# EAGLE design MIU60_REVB (EAGLE 6.5.0)
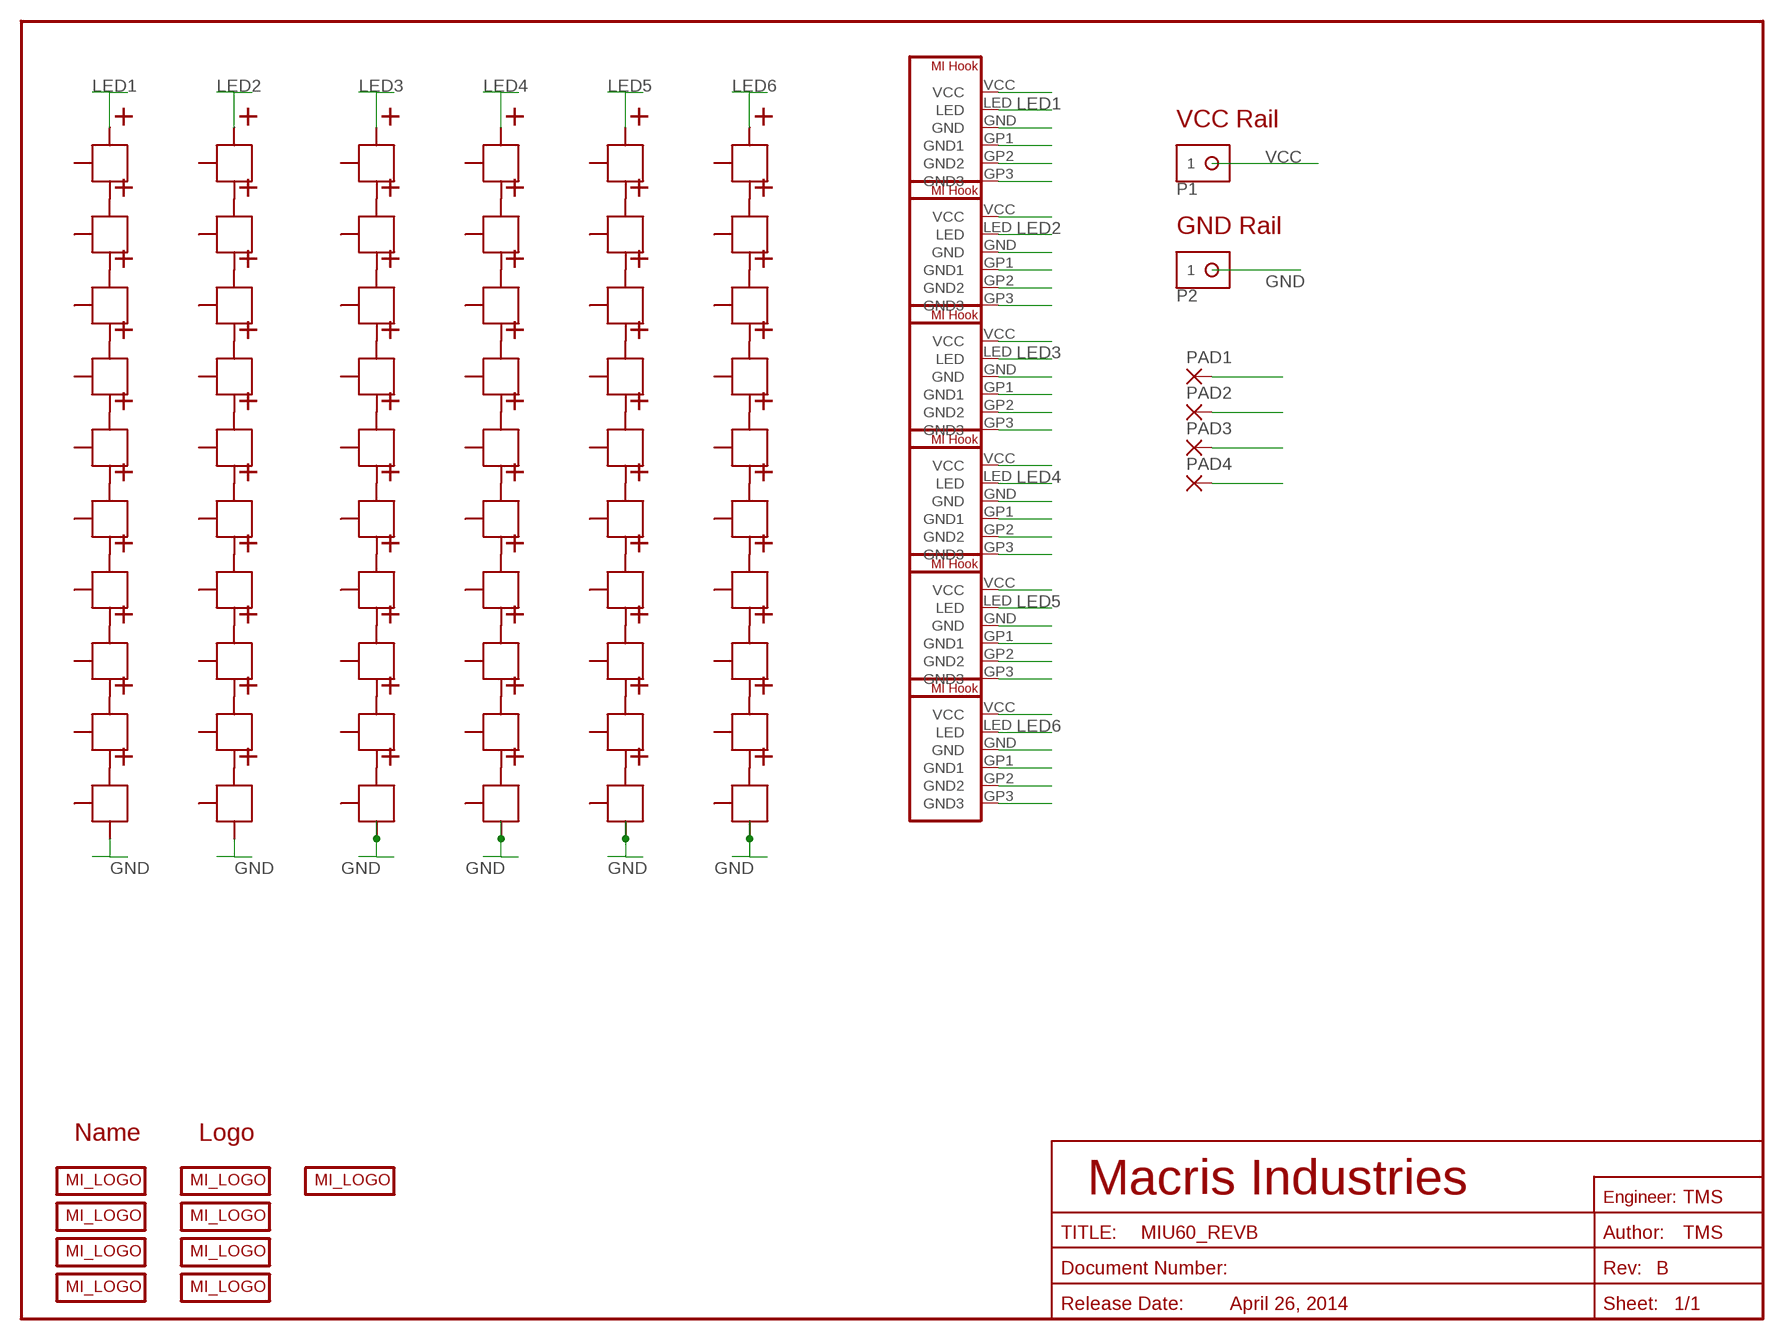
[diagram p0: schematic, sheet 1]

## Parts
P1  PAD-10G  [PAD_10G]
P2  PAD-10G  [PAD_10G]
PAD1  SMD5  [SMD2,54-5,08]
PAD2  SMD5  [SMD2,54-5,08]
PAD3  SMD5  [SMD2,54-5,08]
PAD4  SMD5  [SMD2,54-5,08]
U$1  MI_LOGO-50MIL  MI_LOGO-NAME_TWO  [MI_LOGO_NAME_2]
U$2  MI_LOGO-2014_USA  [MACRIS_USA_LOGO]
U$3  MI_LOGO-50MIL  MI_LOGO-NAME_TWO  [MI_LOGO_NAME_2]
U$4  MI_LOGO-2014_USA  [MACRIS_USA_LOGO]
U$5  MI_LOGO-50MIL  MI_LOGO-NAME_TWO  [MI_LOGO_NAME_2]
U$6  MI_LOGO-50MIL  MI_LOGO-NAME_TWO  [MI_LOGO_NAME_2]
U$7  MI_LOGO-2014_USA  [MACRIS_USA_LOGO]
U$8  MI_LOGO-2014_USA  [MACRIS_USA_LOGO]
U$9  MI_DRIVER_HOOKUP  [MI_DRIVE_HOOKUP]
U$10  MI_DRIVER_HOOKUP  [MI_DRIVE_HOOKUP]
U$11  MI_DRIVER_HOOKUP  [MI_DRIVE_HOOKUP]
U$12  MI_DRIVER_HOOKUP  [MI_DRIVE_HOOKUP]
U$13  MI_DRIVER_HOOKUP  [MI_DRIVE_HOOKUP]
U$14  MI_DRIVER_HOOKUP  [MI_DRIVE_HOOKUP]
U$15  MI_LOGO  [MACRIS_MIU30]
U$16  CREE_XP  [XP]
U$17  CREE_XP  [XP]
U$18  CREE_XP  [XP]
U$19  CREE_XP  [XP]
U$20  CREE_XP  [XP]
U$21  CREE_XP  [XP]
U$22  CREE_XP  [XP]
U$23  CREE_XP  [XP]
U$24  CREE_XP  [XP]
U$25  CREE_XP  [XP]
U$26  CREE_XP  [XP]
U$27  CREE_XP  [XP]
U$28  CREE_XP  [XP]
U$29  CREE_XP  [XP]
U$30  CREE_XP  [XP]
U$31  CREE_XP  [XP]
U$32  CREE_XP  [XP]
U$33  CREE_XP  [XP]
U$34  CREE_XP  [XP]
U$35  CREE_XP  [XP]
U$36  CREE_XP  [XP]
U$37  CREE_XP  [XP]
U$38  CREE_XP  [XP]
U$39  CREE_XP  [XP]
U$40  CREE_XP  [XP]
U$41  CREE_XP  [XP]
U$42  CREE_XP  [XP]
U$43  CREE_XP  [XP]
U$44  CREE_XP  [XP]
U$45  CREE_XP  [XP]
U$46  CREE_XP  [XP]
U$47  CREE_XP  [XP]
U$48  CREE_XP  [XP]
U$49  CREE_XP  [XP]
U$50  CREE_XP  [XP]
U$51  CREE_XP  [XP]
U$52  CREE_XP  [XP]
U$53  CREE_XP  [XP]
U$54  CREE_XP  [XP]
U$55  CREE_XP  [XP]
U$56  CREE_XP  [XP]
U$57  CREE_XP  [XP]
U$58  CREE_XP  [XP]
U$59  CREE_XP  [XP]
U$60  CREE_XP  [XP]
U$61  CREE_XP  [XP]
U$62  CREE_XP  [XP]
U$63  CREE_XP  [XP]
U$64  CREE_XP  [XP]
U$65  CREE_XP  [XP]
U$66  CREE_XP  [XP]
U$67  CREE_XP  [XP]
U$68  CREE_XP  [XP]
U$69  CREE_XP  [XP]
U$70  CREE_XP  [XP]
U$71  CREE_XP  [XP]
U$72  CREE_XP  [XP]
U$73  CREE_XP  [XP]
U$74  CREE_XP  [XP]
U$75  CREE_XP  [XP]

## Nets
GND: P2.1 PAD3.1(P) PAD4.1(P) U$9.GND U$9.GP2(GND2) U$10.GND U$11.GND U$11.GP2(GND2) U$12.GND U$12.GP2(GND2) U$13.GND U$13.GP2(GND2) U$14.GND U$14.GP2(GND2) U$25.NEGATIVE U$25.NEGATIVE1(NEGATIVE) U$35.NEGATIVE U$35.NEGATIVE1(NEGATIVE) U$45.NEGATIVE U$45.NEGATIVE1(NEGATIVE) U$55.NEGATIVE U$55.NEGATIVE1(NEGATIVE) U$65.NEGATIVE U$65.NEGATIVE1(NEGATIVE) U$75.NEGATIVE U$75.NEGATIVE1(NEGATIVE)
LED1: U$9.LED U$16.POSITIVE U$16.POSITIVE1(POSITIVE)
LED2: U$10.LED U$26.POSITIVE U$26.POSITIVE1(POSITIVE)
LED3: U$11.LED U$36.POSITIVE U$36.POSITIVE1(POSITIVE)
LED4: U$12.LED U$46.POSITIVE U$46.POSITIVE1(POSITIVE)
LED5: U$13.LED U$56.POSITIVE U$56.POSITIVE1(POSITIVE)
LED6: U$14.LED U$66.POSITIVE U$66.POSITIVE1(POSITIVE)
N$1: U$16.NEGATIVE U$16.NEGATIVE1(NEGATIVE) U$17.POSITIVE U$17.POSITIVE1(POSITIVE)
N$2: U$17.NEGATIVE U$17.NEGATIVE1(NEGATIVE) U$18.POSITIVE U$18.POSITIVE1(POSITIVE)
N$3: U$18.NEGATIVE U$18.NEGATIVE1(NEGATIVE) U$19.POSITIVE U$19.POSITIVE1(POSITIVE)
N$4: U$19.NEGATIVE U$19.NEGATIVE1(NEGATIVE) U$20.POSITIVE U$20.POSITIVE1(POSITIVE)
N$5: U$20.NEGATIVE U$20.NEGATIVE1(NEGATIVE) U$21.POSITIVE U$21.POSITIVE1(POSITIVE)
N$6: U$21.NEGATIVE U$21.NEGATIVE1(NEGATIVE) U$22.POSITIVE U$22.POSITIVE1(POSITIVE)
N$7: U$22.NEGATIVE U$22.NEGATIVE1(NEGATIVE) U$23.POSITIVE U$23.POSITIVE1(POSITIVE)
N$8: U$23.NEGATIVE U$23.NEGATIVE1(NEGATIVE) U$24.POSITIVE U$24.POSITIVE1(POSITIVE)
N$9: U$24.NEGATIVE U$24.NEGATIVE1(NEGATIVE) U$25.POSITIVE U$25.POSITIVE1(POSITIVE)
N$10: U$56.NEGATIVE U$56.NEGATIVE1(NEGATIVE) U$57.POSITIVE U$57.POSITIVE1(POSITIVE)
N$11: U$57.NEGATIVE U$57.NEGATIVE1(NEGATIVE) U$58.POSITIVE U$58.POSITIVE1(POSITIVE)
N$12: U$26.NEGATIVE U$26.NEGATIVE1(NEGATIVE) U$27.POSITIVE U$27.POSITIVE1(POSITIVE)
N$13: U$27.NEGATIVE U$27.NEGATIVE1(NEGATIVE) U$28.POSITIVE U$28.POSITIVE1(POSITIVE)
N$14: U$28.NEGATIVE U$28.NEGATIVE1(NEGATIVE) U$29.POSITIVE U$29.POSITIVE1(POSITIVE)
N$15: U$29.NEGATIVE U$29.NEGATIVE1(NEGATIVE) U$30.POSITIVE U$30.POSITIVE1(POSITIVE)
N$16: U$30.NEGATIVE U$30.NEGATIVE1(NEGATIVE) U$31.POSITIVE U$31.POSITIVE1(POSITIVE)
N$17: U$32.NEGATIVE U$32.NEGATIVE1(NEGATIVE) U$33.POSITIVE U$33.POSITIVE1(POSITIVE)
N$18: U$33.NEGATIVE U$33.NEGATIVE1(NEGATIVE) U$34.POSITIVE U$34.POSITIVE1(POSITIVE)
N$19: U$34.NEGATIVE U$34.NEGATIVE1(NEGATIVE) U$35.POSITIVE U$35.POSITIVE1(POSITIVE)
N$20: U$31.NEGATIVE U$31.NEGATIVE1(NEGATIVE) U$32.POSITIVE U$32.POSITIVE1(POSITIVE)
N$21: U$66.NEGATIVE U$66.NEGATIVE1(NEGATIVE) U$67.POSITIVE U$67.POSITIVE1(POSITIVE)
N$22: U$13.GP1(GND1)
N$23: U$13.GP3(GND3)
N$24: U$36.NEGATIVE U$36.NEGATIVE1(NEGATIVE) U$37.POSITIVE U$37.POSITIVE1(POSITIVE)
N$25: U$37.NEGATIVE U$37.NEGATIVE1(NEGATIVE) U$38.POSITIVE U$38.POSITIVE1(POSITIVE)
N$26: U$38.NEGATIVE U$38.NEGATIVE1(NEGATIVE) U$39.POSITIVE U$39.POSITIVE1(POSITIVE)
N$27: U$39.NEGATIVE U$39.NEGATIVE1(NEGATIVE) U$40.POSITIVE U$40.POSITIVE1(POSITIVE)
N$28: U$40.NEGATIVE U$40.NEGATIVE1(NEGATIVE) U$41.POSITIVE U$41.POSITIVE1(POSITIVE)
N$29: U$41.NEGATIVE U$41.NEGATIVE1(NEGATIVE) U$42.POSITIVE U$42.POSITIVE1(POSITIVE)
N$30: U$42.NEGATIVE U$42.NEGATIVE1(NEGATIVE) U$43.POSITIVE U$43.POSITIVE1(POSITIVE)
N$31: U$43.NEGATIVE U$43.NEGATIVE1(NEGATIVE) U$44.POSITIVE U$44.POSITIVE1(POSITIVE)
N$32: U$44.NEGATIVE U$44.NEGATIVE1(NEGATIVE) U$45.POSITIVE U$45.POSITIVE1(POSITIVE)
N$33: U$58.NEGATIVE U$58.NEGATIVE1(NEGATIVE) U$59.POSITIVE U$59.POSITIVE1(POSITIVE)
N$34: U$59.NEGATIVE U$59.NEGATIVE1(NEGATIVE) U$60.POSITIVE U$60.POSITIVE1(POSITIVE)
N$35: U$67.NEGATIVE U$67.NEGATIVE1(NEGATIVE) U$68.POSITIVE U$68.POSITIVE1(POSITIVE)
N$36: U$46.NEGATIVE U$46.NEGATIVE1(NEGATIVE) U$47.POSITIVE U$47.POSITIVE1(POSITIVE)
N$37: U$47.NEGATIVE U$47.NEGATIVE1(NEGATIVE) U$48.POSITIVE U$48.POSITIVE1(POSITIVE)
N$38: U$48.NEGATIVE U$48.NEGATIVE1(NEGATIVE) U$49.POSITIVE U$49.POSITIVE1(POSITIVE)
N$39: U$49.NEGATIVE U$49.NEGATIVE1(NEGATIVE) U$50.POSITIVE U$50.POSITIVE1(POSITIVE)
N$40: U$50.NEGATIVE U$50.NEGATIVE1(NEGATIVE) U$51.POSITIVE U$51.POSITIVE1(POSITIVE)
N$41: U$51.NEGATIVE U$51.NEGATIVE1(NEGATIVE) U$52.POSITIVE U$52.POSITIVE1(POSITIVE)
N$42: U$52.NEGATIVE U$52.NEGATIVE1(NEGATIVE) U$53.POSITIVE U$53.POSITIVE1(POSITIVE)
N$43: U$53.NEGATIVE U$53.NEGATIVE1(NEGATIVE) U$54.POSITIVE U$54.POSITIVE1(POSITIVE)
N$44: U$68.NEGATIVE U$68.NEGATIVE1(NEGATIVE) U$69.POSITIVE U$69.POSITIVE1(POSITIVE)
N$45: U$14.GP1(GND1)
N$46: U$54.NEGATIVE U$54.NEGATIVE1(NEGATIVE) U$55.POSITIVE U$55.POSITIVE1(POSITIVE)
N$47: U$60.NEGATIVE U$60.NEGATIVE1(NEGATIVE) U$61.POSITIVE U$61.POSITIVE1(POSITIVE)
N$48: U$61.NEGATIVE U$61.NEGATIVE1(NEGATIVE) U$62.POSITIVE U$62.POSITIVE1(POSITIVE)
N$49: U$62.NEGATIVE U$62.NEGATIVE1(NEGATIVE) U$63.POSITIVE U$63.POSITIVE1(POSITIVE)
N$50: U$63.NEGATIVE U$63.NEGATIVE1(NEGATIVE) U$64.POSITIVE U$64.POSITIVE1(POSITIVE)
N$51: U$64.NEGATIVE U$64.NEGATIVE1(NEGATIVE) U$65.POSITIVE U$65.POSITIVE1(POSITIVE)
N$52: U$69.NEGATIVE U$69.NEGATIVE1(NEGATIVE) U$70.POSITIVE U$70.POSITIVE1(POSITIVE)
N$53: U$70.NEGATIVE U$70.NEGATIVE1(NEGATIVE) U$71.POSITIVE U$71.POSITIVE1(POSITIVE)
N$54: U$71.NEGATIVE U$71.NEGATIVE1(NEGATIVE) U$72.POSITIVE U$72.POSITIVE1(POSITIVE)
N$55: U$72.NEGATIVE U$72.NEGATIVE1(NEGATIVE) U$73.POSITIVE U$73.POSITIVE1(POSITIVE)
N$56: U$73.NEGATIVE U$73.NEGATIVE1(NEGATIVE) U$74.POSITIVE U$74.POSITIVE1(POSITIVE)
N$57: U$74.NEGATIVE U$74.NEGATIVE1(NEGATIVE) U$75.POSITIVE U$75.POSITIVE1(POSITIVE)
N$60: U$14.GP3(GND3)
N$61: U$10.GP3(GND3)
N$62: U$10.GP2(GND2)
N$63: U$10.GP1(GND1)
N$65: U$11.GP1(GND1)
N$66: U$11.GP3(GND3)
N$68: U$12.GP1(GND1)
N$69: U$12.GP3(GND3)
N$71: U$9.GP1(GND1)
N$72: U$9.GP3(GND3)
VCC: P1.1 PAD1.1(P) PAD2.1(P) U$9.VCC U$10.VCC U$11.VCC U$12.VCC U$13.VCC U$14.VCC
Unconnected: U$16.THERMAL U$17.THERMAL U$18.THERMAL U$19.THERMAL U$20.THERMAL U$21.THERMAL U$22.THERMAL U$23.THERMAL U$24.THERMAL U$25.THERMAL U$26.THERMAL U$27.THERMAL U$28.THERMAL U$29.THERMAL U$30.THERMAL U$31.THERMAL U$32.THERMAL U$33.THERMAL U$34.THERMAL U$35.THERMAL U$36.THERMAL U$37.THERMAL U$38.THERMAL U$39.THERMAL U$40.THERMAL U$41.THERMAL U$42.THERMAL U$43.THERMAL U$44.THERMAL U$45.THERMAL U$46.THERMAL U$47.THERMAL U$48.THERMAL U$49.THERMAL U$50.THERMAL U$51.THERMAL U$52.THERMAL U$53.THERMAL U$54.THERMAL U$55.THERMAL U$56.THERMAL U$57.THERMAL U$58.THERMAL U$59.THERMAL U$60.THERMAL U$61.THERMAL U$62.THERMAL U$63.THERMAL U$64.THERMAL U$65.THERMAL U$66.THERMAL U$67.THERMAL U$68.THERMAL U$69.THERMAL U$70.THERMAL U$71.THERMAL U$72.THERMAL U$73.THERMAL U$74.THERMAL U$75.THERMAL

## Notes on the sheet
- VCC Rail
- GND Rail
- Name | Logo
- Macris Industries
- TMS
- TMS
- B
- April 26, 2014

## Library data of the parts
P1 P2 = Mechanical:PAD: Solder Pads
PAD1-PAD4 = wirepad:SMD5: SMD PAD
U$1-U$8 U$15 = Logo:MI_LOGO
U$9-U$14 = Mechanical:MI_DRIVER_HOOKUP
U$16-U$75 = Cree_XP:CREE_XP

## Board
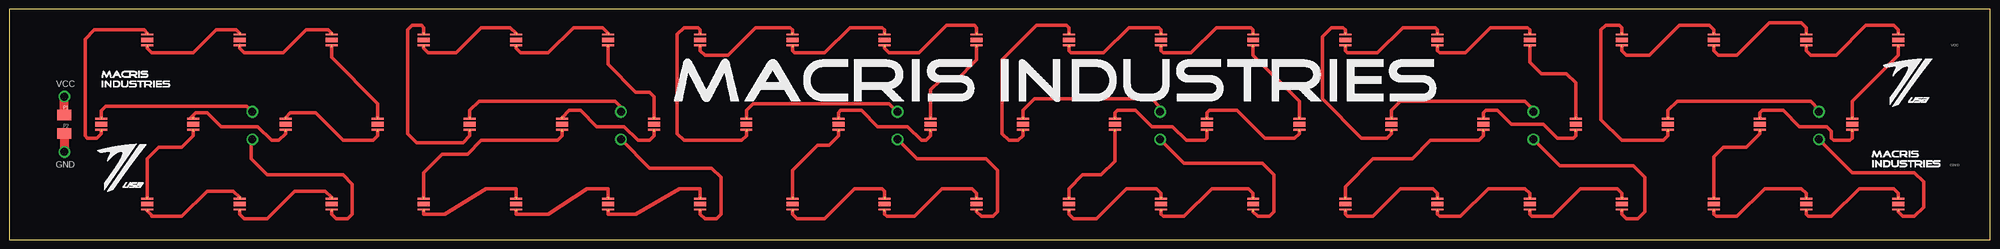
[diagram p1: board, top side]
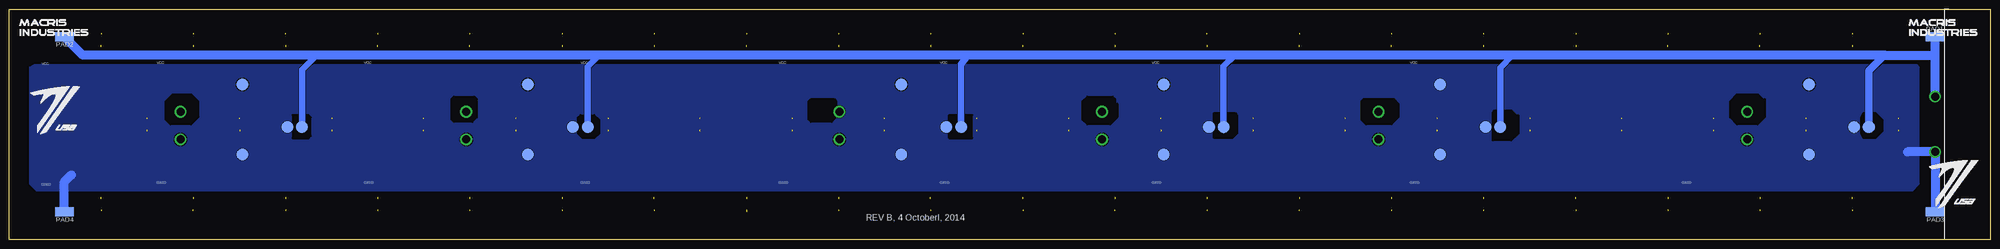
[diagram p2: board, bottom side, seen from below]

Size 546.1 x 63.5 mm. Coordinates in mm from the lower left corner, seen from the top.
Outline: 0,0 546.1,0 546.1,63.5 0,63.5 0,0
Copper layers (1*16): Top 0.0356mm / dielectric 1.5011mm / Bottom 0.0356mm
Design rules "oshPark": minimum track width 6mil, minimum drill 13mil, track to track 6mil, track to pad 6mil, pad to pad 6mil, via to via 6mil, smd to smd 6mil, copper to edge 15mil, drill to drill 6mil, minimum pad ring 7mil, minimum via ring 7mil, stop-mask expansion 4mil, vias tented up to drill 0mil, thermal gap 10mil
bRestrict: 93 lines

### Footprints (pad centres in the part's own frame; a part is rotated, then mirrored left to right if it is on the bottom)
PAD_10G = smd 3.81 x 2.921: 1 0,0
SMD2,54-5,08 = smd 2.54 x 5.08: 1 0,0
MI_DRIVE_HOOKUP = drill 2.2: GND 36.576,7.264; LED 36.576,14.884 | smd 3.302 x 3.302 bottom: GP1 19.558,3.048; GP2 19.558,22.352; GP3 7.112,10.668; VCC 3.048,10.668
XP = smd 0.5 x 3.3: NEGATIVE 1.5,0; POSITIVE -1.5,0 | smd 0.4 x 0.5: NEGATIVE1 1.85,0; POSITIVE1 -1.85,0 | smd 1.3 x 3.3: THERMAL 0,0

### Placement (x,y rotation side)
P1  15.24,34.29 180 top
P2  15.24,29.21 180 top
PAD1  15.24,55.88 270 bottom
PAD2  530.86,55.88 90 bottom
PAD3  15.24,7.62 90 bottom
PAD4  530.86,7.62 90 bottom
U$1  25.15,41.66 0 top
U$2  515.62,35.56 0 top
U$3  513.08,19.68 0 top
U$4  541.02,27.94 0 bottom
U$5  22.86,55.88 0 bottom
U$6  543.56,55.88 0 bottom
U$7  23.5,12.06 0 top
U$8  17.78,7.62 0 bottom
U$9  30.48,20.32 0 top
U$10  132.08,20.32 0 top
U$11  208.28,20.32 0 top
U$12  280.67,20.32 0 top
U$13  383.54,20.32 0 top
U$14  462.28,20.32 0 top
U$15  182.88,37.47 0 top
U$16  25.4,31.75 270 top
U$17  38.1,55.02 270 top
U$18  63.5,55.02 270 top
U$19  88.9,55.02 270 top
U$20  101.6,31.75 270 top
U$21  76.2,31.75 270 top
U$22  50.8,31.75 270 top
U$23  38.1,9.75 270 top
U$24  63.5,9.75 270 top
U$25  88.9,9.75 270 top
U$26  127,31.75 270 top
U$27  114.3,55.02 270 top
U$28  139.7,55.02 270 top
U$29  165.1,55.02 270 top
U$30  177.8,31.75 270 top
U$31  152.4,31.75 270 top
U$32  114.3,9.75 270 top
U$33  139.7,9.75 270 top
U$34  165.1,9.75 270 top
U$35  190.5,9.75 270 top
U$36  203.2,31.75 270 top
U$37  190.5,55.02 270 top
U$38  215.9,55.02 270 top
U$39  241.3,55.02 270 top
U$40  266.7,55.02 270 top
U$41  254,31.75 270 top
U$42  228.6,31.75 270 top
U$43  215.9,9.75 270 top
U$44  241.3,9.75 270 top
U$45  266.7,9.75 270 top
U$46  279.4,31.75 270 top
U$47  292.1,55.02 270 top
U$48  317.5,55.02 270 top
U$49  342.9,55.02 270 top
U$50  355.6,31.75 270 top
U$51  330.2,31.75 270 top
U$52  304.8,31.75 270 top
U$53  292.1,9.75 270 top
U$54  317.5,9.75 270 top
U$55  342.9,9.75 270 top
U$56  381,31.75 270 top
U$57  368.3,55.02 270 top
U$58  393.7,55.02 270 top
U$59  419.1,55.02 270 top
U$60  431.8,31.75 270 top
U$61  406.4,31.75 270 top
U$62  368.3,9.75 270 top
U$63  393.7,9.75 270 top
U$64  419.1,9.75 270 top
U$65  444.5,9.75 270 top
U$66  457.2,31.75 270 top
U$67  444.5,55.02 270 top
U$68  469.9,55.02 270 top
U$69  495.3,55.02 270 top
U$70  520.7,55.02 270 top
U$71  508,31.75 270 top
U$72  482.6,31.75 270 top
U$73  469.9,9.75 270 top
U$74  495.3,9.75 270 top
U$75  520.7,9.75 270 top

### Tracks (layer width: path | path; a pad name or v marks a point on that pad's centre or on a via)
GND  (via drill 2.2)  (7 unrouted)
  Top 1.016: U$35.NEGATIVE1 190.5,6.99 191.77,5.71 194.94,5.71 196.22,6.99 196.22,17.14 193.68,19.68 176.56,19.68 U$10.GND | U$25.NEGATIVE1 88.9,6.99 90.17,5.71 93.34,5.71 94.61,6.99 94.61,15.24 92.08,17.78 71.12,17.78 66.67,22.23 66.67,27.2 U$9.GND | U$45.NEGATIVE1 266.7,7.62 267.97,6.35 271.14,6.35 272.42,7.62 272.42,19.05 269.24,22.23 250.22,22.23 U$11.GND | 342.9,7.62 344.17,6.35 347.35,6.35 348.62,7.62 348.62,17.78 345.44,20.95 323.88,20.95 U$12.GND | U$65.NEGATIVE1 444.5,6.99 445.77,5.71 448.94,5.71 450.85,7.62 450.85,17.14 447.68,20.32 427.38,20.32 U$13.GND | U$75.NEGATIVE1 520.7,7.62 521.97,6.35 525.14,6.35 527.68,8.89 527.68,15.88 525.14,18.41 508.02,18.41 U$14.GND
  Top 2.54: P2.1 v15.24,24.13
  Bottom 2.54: PAD3.1 v15.24,24.13 22.86,24.13 | PAD4.1 530.86,15.88 528.96,17.78
  pour Bottom: 20.32,48.26 19.68,47.62 19.68,15.24 21.59,13.34 538.48,13.34 540.38,15.24 540.38,47.62 539.12,48.26
LED1  (1 unrouted)
  Top 1.016: U$9.LED 65.56,36.7 26.67,36.7 25.4,35.43 U$16.POSITIVE1
LED2  (1 unrouted)
  Top 1.016: U$10.LED 168.66,36.45 167,38.1 129.54,38.1 127,35.56 U$26.POSITIVE1
LED3  (1 unrouted)
  Top 1.016: U$11.LED 244.83,35.2 242.57,37.47 205.1,37.47 203.2,35.56 U$36.POSITIVE1
LED4  (1 unrouted)
  Top 1.016: U$12.LED 317.25,36.45 314.96,38.73 282.57,38.73 279.4,35.56 U$46.POSITIVE1
LED5  (1 unrouted)
  Top 1.016: U$13.LED 420.12,35.81 417.83,38.1 383.54,38.1 381,35.56 U$56.POSITIVE1
LED6  (1 unrouted)
  Top 1.016: U$14.LED 498.86,35.81 496.57,38.1 459.74,38.1 457.2,35.56 U$66.POSITIVE1
N$1  (2 unrouted)
  Top 1.016: U$16.NEGATIVE1 25.4,29.21 24.13,27.94 21.59,27.94 20.95,28.57 20.95,55.24 23.5,57.78 37.18,57.78 U$17.POSITIVE1
N$2  (2 unrouted)
  Top 1.016: U$17.NEGATIVE1 38.1,52.7 39.37,51.44 50.8,51.44 57.15,57.78 62.58,57.78 U$18.POSITIVE1
N$3  (2 unrouted)
  Top 1.016: U$18.NEGATIVE 63.5,52.7 64.77,51.44 75.56,51.44 81.92,57.78 87.98,57.78 U$19.POSITIVE1
N$4  (2 unrouted)
  Top 1.016: U$20.POSITIVE1 101.6,37.47 88.9,50.16 U$19.NEGATIVE1
N$5  (2 unrouted)
  Top 1.016: U$21.POSITIVE1 77.53,34.92 84.45,34.92 92.08,27.3 100.33,27.3 101.6,28.57 U$20.NEGATIVE1
N$6  (2 unrouted)
  Top 1.016: U$21.NEGATIVE1 76.2,29.21 74.3,27.3 72.39,27.3 68.58,31.11 58.42,31.11 54.61,34.92 51.44,34.92 50.16,33.66 50.74,33.66 U$22.POSITIVE1
N$7  (2 unrouted)
  Top 1.016: U$23.POSITIVE1 38.1,22.23 41.27,25.4 47.62,25.4 50.8,28.57 U$22.NEGATIVE1
N$8  (2 unrouted)
  Top 1.016: U$24.POSITIVE1 61.77,13.34 54.61,13.34 47.62,6.35 39.37,6.35 39.37,6.63 U$23.NEGATIVE1
N$9  (2 unrouted)
  Top 1.016: U$24.NEGATIVE1 63.5,6.99 64.77,5.71 71.12,5.71 78.74,13.34 87.17,13.34 U$25.POSITIVE1
N$10  (2 unrouted)
  Top 1.016: U$56.NEGATIVE1 381,29.21 379.73,27.94 372.75,27.94 361.95,38.73 361.95,55.88 364.49,58.42 367.67,58.42 368.3,57.78 U$57.POSITIVE1
N$11  (2 unrouted)
  Top 1.016: U$57.NEGATIVE1 368.3,52.07 368.94,51.44 377.19,51.44 384.18,58.42 393.06,58.42 393.7,57.78 U$58.POSITIVE1
N$12  (2 unrouted)
  Top 1.016: U$26.NEGATIVE1 127,28.57 125.09,26.67 112.39,26.67 109.86,29.21 109.86,57.78 111.12,59.05 113.67,59.05 114.3,58.42 U$27.POSITIVE1
N$13  (2 unrouted)
  Top 1.016: U$28.POSITIVE1 138.15,58.42 130.18,58.42 123.19,51.44 115.57,51.44 114.3,52.7 U$27.NEGATIVE1
N$14  (2 unrouted)
  Top 1.016: U$28.NEGATIVE1 139.7,52.7 140.97,51.44 148.59,51.44 155.57,58.42 163.55,58.42 U$29.POSITIVE1
N$15  (2 unrouted)
  Top 1.016: U$30.POSITIVE1 177.8,39.37 176.53,40.64 172.72,40.64 165.1,48.26 U$29.NEGATIVE1
N$16  (2 unrouted)
  Top 1.016: U$30.NEGATIVE1 177.8,28.57 176.53,27.3 173.35,27.3 169.54,31.11 161.93,31.11 157.48,35.56 154.36,35.56 U$31.POSITIVE1
N$17  (2 unrouted)
  Top 1.016: U$32.NEGATIVE1 114.3,6.99 120.02,6.99 131.44,13.97 139.7,13.97 U$33.POSITIVE1
N$18  (2 unrouted)
  Top 1.016: U$33.NEGATIVE1 139.7,6.99 148.59,6.99 159.38,13.97 165.1,13.97 U$34.POSITIVE1
N$19  (2 unrouted)
  Top 1.016: U$34.NEGATIVE1 165.1,6.99 172.72,6.99 184.78,13.97 190.5,13.97 U$35.POSITIVE1
N$20  (2 unrouted)
  Top 1.016: U$32.POSITIVE1 114.3,18.41 119.38,23.5 126.36,23.5 130.18,27.3 151.13,27.3 152.4,28.57 U$31.NEGATIVE1
N$21  (2 unrouted)
  Top 1.016: U$66.NEGATIVE1 457.2,28.57 455.93,27.3 444.5,27.3 438.79,33.02 438.79,57.78 440.06,59.05 443.87,59.05 444.5,58.42 U$67.POSITIVE1
N$24  (2 unrouted)
  Top 1.016: U$36.NEGATIVE1 203.2,28.57 201.93,27.3 186.06,27.3 184.15,29.21 184.15,56.52 186.06,58.42 189.87,58.42 190.5,57.78 U$37.POSITIVE1
N$25  (2 unrouted)
  Top 1.016: U$37.NEGATIVE1 190.5,52.07 191.77,50.8 198.12,50.8 205.74,58.42 215.26,58.42 215.9,57.78 U$38.POSITIVE1
N$26  (2 unrouted)
  Top 1.016: U$38.NEGATIVE1 215.9,52.07 216.53,51.44 224.79,51.44 231.78,58.42 240.66,58.42 241.3,57.78 U$39.POSITIVE1
N$27  (2 unrouted)
  Top 1.016: U$39.NEGATIVE1 241.3,52.7 242.57,51.44 250.82,51.44 258.44,59.05 266.06,59.05 266.7,58.42 U$40.POSITIVE1
N$28  (2 unrouted)
  Top 1.016: U$41.POSITIVE1 254,41.27 256.54,43.81 260.99,43.81 266.7,49.53 U$40.NEGATIVE1
N$29  (2 unrouted)
  Top 1.016: U$41.NEGATIVE1 254,28.57 252.73,27.3 251.46,27.3 247.65,31.11 239.4,31.11 234.95,35.56 229.24,35.56 228.6,34.92 U$42.POSITIVE1
N$30  (2 unrouted)
  Top 1.016: U$43.POSITIVE1 215.9,19.05 222.88,26.04 226.06,26.04 228.6,28.57 U$42.NEGATIVE1
N$31  (2 unrouted)
  Top 1.016: U$43.NEGATIVE1 215.9,6.99 217.17,5.71 224.79,5.71 233.04,13.97 240.66,13.97 241.3,13.34 U$44.POSITIVE1
N$32  (2 unrouted)
  Top 1.016: U$44.NEGATIVE1 241.3,6.99 241.94,6.35 249.56,6.35 257.18,13.97 265.43,13.97 266.7,12.7 U$45.POSITIVE1
N$33  (2 unrouted)
  Top 1.016: U$58.NEGATIVE1 393.7,52.07 394.33,51.44 401.32,51.44 408.31,58.42 418.46,58.42 419.1,57.78 U$59.POSITIVE1
N$34  (2 unrouted)
  Top 1.016: U$60.POSITIVE1 431.8,43.18 429.26,45.72 422.27,45.72 419.1,48.9 U$59.NEGATIVE1
N$35  (2 unrouted)
  Top 1.016: U$67.NEGATIVE1 444.5,52.07 445.77,50.8 452.12,50.8 460.38,59.05 468.63,59.05 469.9,57.78 U$68.POSITIVE1
N$36  (2 unrouted)
  Top 1.016: U$46.NEGATIVE1 279.4,28.57 278.13,27.3 275.59,27.3 273.69,29.21 273.69,49.53 283.21,59.05 291.46,59.05 292.1,58.42 U$47.POSITIVE1
N$37  (2 unrouted)
  Top 1.016: U$47.NEGATIVE1 292.1,52.07 292.74,51.44 301.62,51.44 308.61,58.42 316.87,58.42 317.5,57.78 U$48.POSITIVE1
N$38  (2 unrouted)
  Top 1.016: U$48.NEGATIVE1 317.5,52.07 318.13,51.44 325.75,51.44 332.74,58.42 342.26,58.42 342.9,57.78 U$49.POSITIVE1
N$39  (2 unrouted)
  Top 1.016: U$50.POSITIVE1 355.6,38.1 342.9,50.8 U$49.NEGATIVE1
N$40  (2 unrouted)
  Top 1.016: U$50.NEGATIVE1 355.6,29.21 354.33,27.94 346.07,27.94 338.45,35.56 330.83,35.56 330.2,34.92 U$51.POSITIVE1
N$41  (2 unrouted)
  Top 1.016: U$51.NEGATIVE1 330.2,27.94 329.56,27.3 324.49,27.3 320.68,31.11 314.96,31.11 310.51,35.56 305.44,35.56 304.8,34.92 U$52.POSITIVE1
N$42  (2 unrouted)
  Top 1.016: U$52.NEGATIVE1 304.8,21.59 300.99,17.78 295.91,17.78 292.1,13.97 U$53.POSITIVE1
N$43  (2 unrouted)
  Top 1.016: U$53.NEGATIVE1 292.1,6.99 293.37,5.71 299.72,5.71 307.98,13.97 316.23,13.97 317.5,12.7 U$54.POSITIVE1
N$44  (2 unrouted)
  Top 1.016: U$68.NEGATIVE1 469.9,52.07 471.17,50.8 476.25,50.8 485.14,59.69 494.03,59.69 495.3,58.42 U$69.POSITIVE1
N$46  (2 unrouted)
  Top 1.016: U$54.NEGATIVE1 317.5,6.99 318.13,6.35 323.85,6.35 331.47,13.97 341.63,13.97 342.9,12.7 U$55.POSITIVE1
N$47  (2 unrouted)
  Top 1.016: U$60.NEGATIVE1 431.8,28.57 431.17,27.94 426.72,27.94 422.91,31.75 414.02,31.75 410.21,35.56 407.04,35.56 406.4,34.92 U$61.POSITIVE1
N$48  (2 unrouted)
  Top 1.016: U$61.NEGATIVE1 406.4,28.57 405.13,27.3 391.8,27.3 386.71,22.23 375.92,22.23 368.3,14.61 U$62.POSITIVE1
N$49  (2 unrouted)
  Top 1.016: U$62.NEGATIVE1 368.3,6.99 368.94,6.35 375.92,6.35 383.54,13.97 392.43,13.97 393.7,12.7 U$63.POSITIVE1
N$50  (2 unrouted)
  Top 1.016: U$63.NEGATIVE1 393.7,6.99 394.33,6.35 400.05,6.35 407.67,13.97 417.83,13.97 419.1,12.7 U$64.POSITIVE1
N$51  (2 unrouted)
  Top 1.016: U$64.NEGATIVE1 419.1,6.99 419.74,6.35 425.45,6.35 433.07,13.97 443.23,13.97 444.5,12.7 U$65.POSITIVE1
N$52  (2 unrouted)
  Top 1.016: U$69.NEGATIVE1 495.3,52.07 496.57,50.8 503.56,50.8 511.81,59.05 519.43,59.05 520.7,57.78 U$70.POSITIVE1
N$53  (2 unrouted)
  Top 1.016: U$71.POSITIVE1 508,38.1 520.7,50.8 U$70.NEGATIVE1
N$54  (2 unrouted)
  Top 1.016: U$71.NEGATIVE1 508,27.94 507.37,27.3 502.92,27.3 502.29,27.94 502.29,29.84 501.01,31.11 493.39,31.11 488.95,35.56 483.24,35.56 482.6,34.92 U$72.POSITIVE1
N$55  (2 unrouted)
  Top 1.016: U$72.NEGATIVE1 482.6,29.21 478.79,25.4 472.44,25.4 469.9,22.86 U$73.POSITIVE1
N$56  (2 unrouted)
  Top 1.016: U$73.NEGATIVE1 469.9,6.99 470.54,6.35 476.25,6.35 483.87,13.97 494.03,13.97 495.3,12.7 U$74.POSITIVE1
N$57  (2 unrouted)
  Top 1.016: U$74.NEGATIVE1 495.3,6.99 495.94,6.35 502.29,6.35 509.9,13.97 519.43,13.97 520.7,12.7 U$75.POSITIVE1
VCC  (via drill 2.2 pad 2.18)
  Top 2.54: P1.1 v15.24,39.37
  Bottom 1.016: 29.21,50.8 29.84,50.16
  Bottom 1.778: 383.54,50.8 383.41,50.8 386.59,47.62 U$13.VCC | 461.64,50.8 461.26,50.8 465.33,46.74 U$14.VCC | U$10.VCC 135.13,47.37 131.7,50.8 | U$11.VCC 211.33,47.75 208.28,50.8 | U$12.VCC 283.72,48.26 281.81,50.8
  Bottom 2.032: U$9.VCC 33.53,46.48 29.84,50.16
  Bottom 2.54: v15.24,39.37 15.24,50.8 | 15.24,50.8 PAD1.1 | 15.24,50.8 29.21,50.8 131.7,50.8 208.28,50.8 281.81,50.8 383.54,50.8 461.64,50.8 525.78,50.8 PAD2.1

### Text on the board
bPlace: REV B, 4 Octoberl, 2014
tNames: VCC | VCC | GND | GND
bNames: VCC | VCC | VCC | VCC | VCC | VCC | VCC | VCC | GND | GND | GND | GND | GND | GND | GND | GND | GND
Document: 21.50" | .866" | 2.5" | .384" | 1.0"